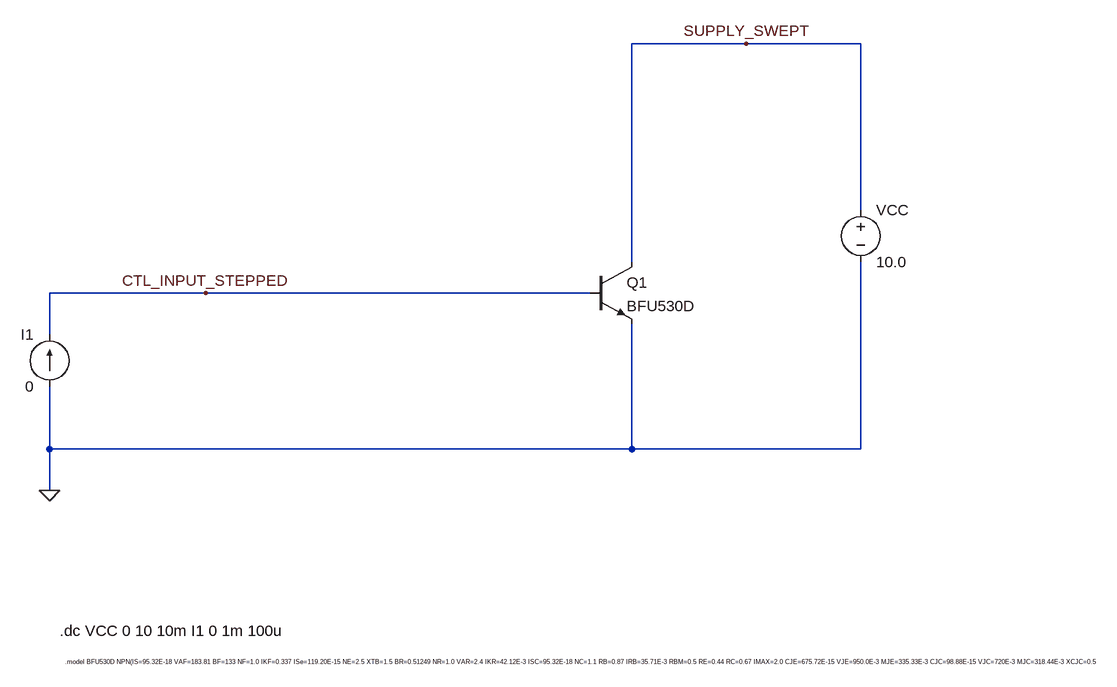
[diagram p0: schematic BFU530WXD_Test_Bench.asc]
BFU530WXD_Test_Bench.asc, the LTspice schematic file:
Version 4.1
SHEET 1 5052 1700
WIRE 784 -144 608 -144
WIRE 960 -144 784 -144
WIRE 960 112 960 -144
WIRE 608 192 608 -144
WIRE -48 240 -288 240
WIRE 544 240 -48 240
WIRE -288 304 -288 240
WIRE -288 480 -288 384
WIRE 608 480 608 288
WIRE 608 480 -288 480
WIRE 960 480 960 192
WIRE 960 480 608 480
WIRE -288 544 -288 480
FLAG -288 544 0
FLAG -48 240 CTL_INPUT_STEPPED
FLAG 784 -144 SUPPLY_SWEPT
SYMBOL voltage 960 96 R0
WINDOW 123 0 0 Left 0
WINDOW 39 0 0 Left 0
SYMATTR InstName VCC
SYMATTR Value 10.0
SYMBOL npn 544 192 R0
SYMATTR InstName Q1
SYMATTR Value BFU530D
SYMBOL current -288 384 R180
WINDOW 0 24 80 Left 2
WINDOW 3 24 0 Left 2
WINDOW 123 0 0 Left 0
WINDOW 39 0 0 Left 0
SYMATTR InstName I1
SYMATTR Value 0
TEXT -272 760 Left 2 !.dc VCC 0 10 10m I1 0 1m 100u
TEXT -264 808 Left 0 !.model BFU530D NPN(IS=95.32E-18 VAF=183.81 BF=133 NF=1.0 IKF=0.337 ISe=119.20E-15 NE=2.5 XTB=1.5 BR=0.51249 NR=1.0 VAR=2.4 IKR=42.12E-3 ISC=95.32E-18 NC=1.1 RB=0.87 IRB=35.71E-3 RBM=0.5 RE=0.44 RC=0.67 IMAX=2.0 CJE=675.72E-15 VJE=950.0E-3 MJE=335.33E-3 CJC=98.88E-15 VJC=720E-3 MJC=318.44E-3 XCJC=0.5 FC=850.0E-3 TF=10.04E-12 XTF=10.0 VTF=1.0 ITF=56.74E-3 PTF=0.0 TR=0.0 KF=109.67E-12 AF=2.0)

The netlist it stands for:
* BFU530WXD_Test_Bench.asc
VCC SUPPLY_SWEPT 0 10.0
Q1 SUPPLY_SWEPT CTL_INPUT_STEPPED 0 0 BFU530D
I1 0 CTL_INPUT_STEPPED 0
.model NPN NPN
.model PNP PNP
.lib standard.bjt
.dc VCC 0 10 10m I1 0 1m 100u
.model BFU530D NPN(IS=95.32E-18 VAF=183.81 BF=133 NF=1.0 IKF=0.337 ISe=119.20E-15 NE=2.5 XTB=1.5 BR=0.51249 NR=1.0 VAR=2.4 IKR=42.12E-3 ISC=95.32E-18 NC=1.1 RB=0.87 IRB=35.71E-3 RBM=0.5 RE=0.44 RC=0.67 IMAX=2.0 CJE=675.72E-15 VJE=950.0E-3 MJE=335.33E-3 CJC=98.88E-15 VJC=720E-3 MJC=318.44E-3 XCJC=0.5 FC=850.0E-3 TF=10.04E-12 XTF=10.0 VTF=1.0 ITF=56.74E-3 PTF=0.0 TR=0.0 KF=109.67E-12 AF=2.0)
.backanno
.end